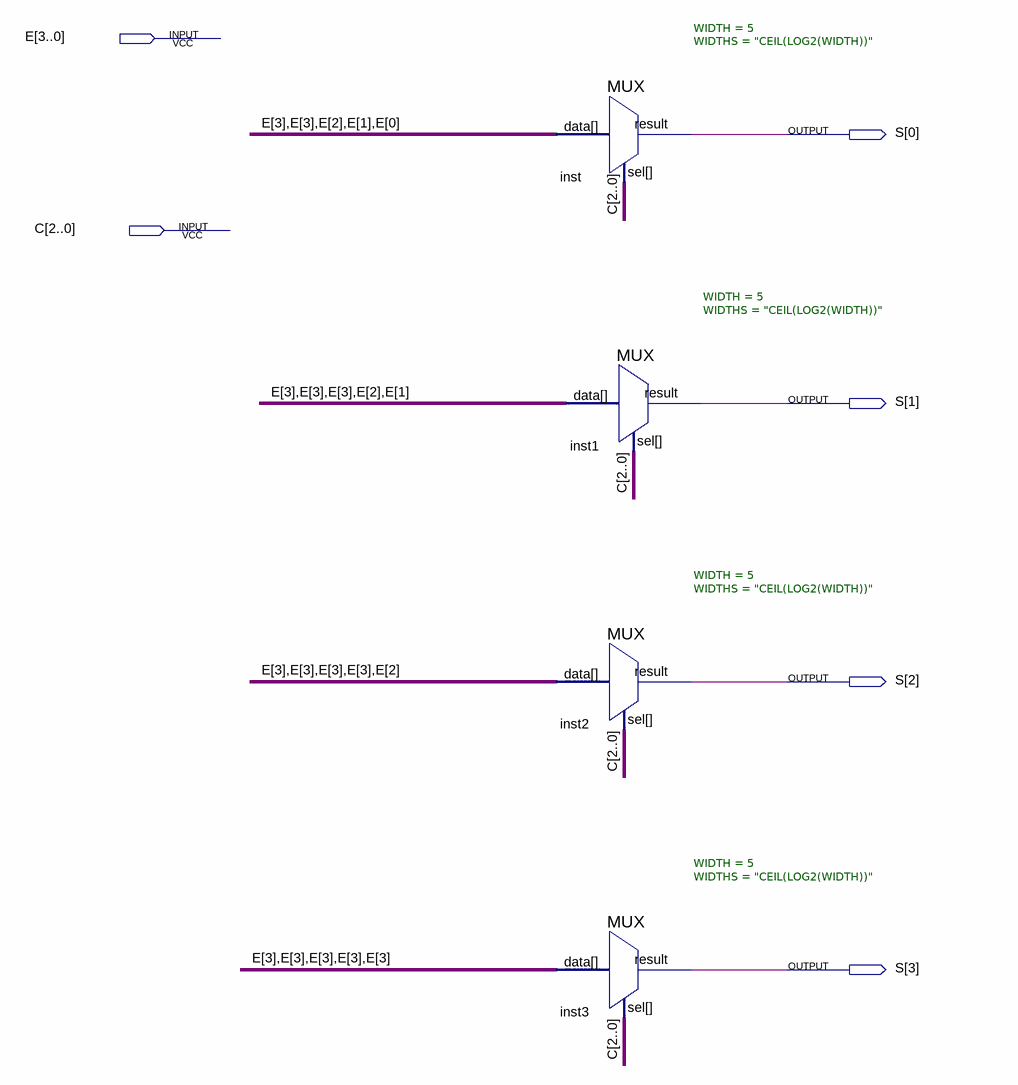
[diagram p0: schematic sheet]
// Quartus schematic shift_r.bdf as structural Verilog: 4 symbols, 6 pins
module shift_r (
  input  [3:0] E,
  input  [2:0] C,
  output [3:0] S
);

  MUX #(.WIDTH(5), .WIDTHS("CEIL(LOG2(WIDTH))")) inst (.data({{2{E[3]}}, E[2:0]}), .sel(C), .result(S[0]));
  MUX #(.WIDTH(5), .WIDTHS("CEIL(LOG2(WIDTH))")) inst1 (.data({{3{E[3]}}, E[2:1]}), .sel(C), .result(S[1]));
  MUX #(.WIDTH(5), .WIDTHS("CEIL(LOG2(WIDTH))")) inst2 (.data({{4{E[3]}}, E[2]}), .sel(C), .result(S[2]));
  MUX #(.WIDTH(5), .WIDTHS("CEIL(LOG2(WIDTH))")) inst3 (.data({5{E[3]}}), .sel(C), .result(S[3]));
endmodule
